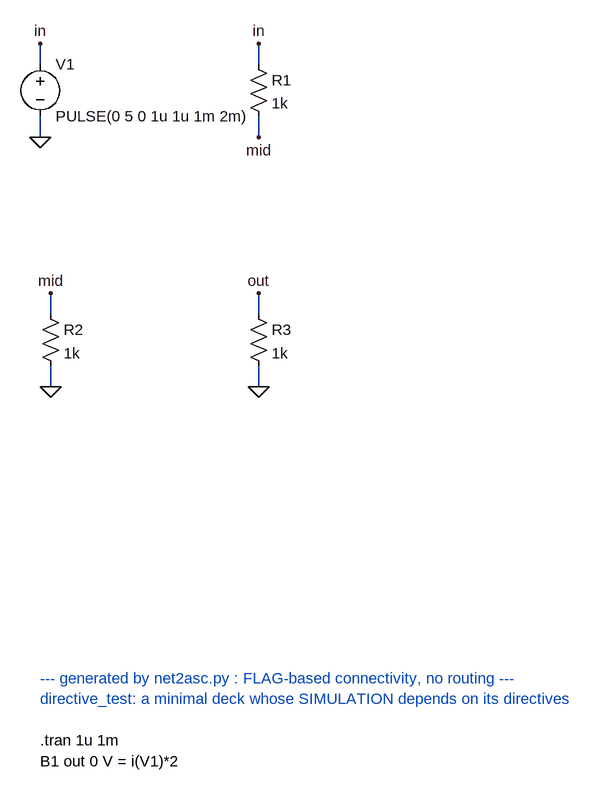
[diagram p0: schematic corrupt_I_icdel.asc]
corrupt_I_icdel.asc, the LTspice schematic file:
Version 4
SHEET 1 880 1288
WIRE 0 16 0 -16
WIRE 0 96 0 128
WIRE 336 16 336 -16
WIRE 336 96 336 128
WIRE 16 400 16 368
WIRE 16 480 16 512
WIRE 336 400 336 368
WIRE 336 480 336 512
FLAG 0 -16 in
FLAG 0 128 0
FLAG 336 -16 in
FLAG 336 128 mid
FLAG 16 368 mid
FLAG 16 512 0
FLAG 336 368 out
FLAG 336 512 0
SYMBOL voltage 0 0 R0
SYMATTR InstName V1
SYMATTR Value PULSE(0 5 0 1u 1u 1m 2m)
SYMBOL res 320 0 R0
SYMATTR InstName R1
SYMATTR Value 1k
SYMBOL res 0 384 R0
SYMATTR InstName R2
SYMATTR Value 1k
SYMBOL res 320 384 R0
SYMATTR InstName R3
SYMATTR Value 1k
TEXT 0 960 Left 2 ;--- generated by net2asc.py : FLAG-based connectivity, no routing ---
TEXT 0 992 Left 2 ;directive_test: a minimal deck whose SIMULATION depends on its directives
TEXT 0 1056 Left 2 !.tran 1u 1m
TEXT 0 1088 Left 2 !B1 out 0 V = i(V1)*2

The netlist it stands for:
* corrupt_I_icdel.asc
V1 in 0 PULSE(0 5 0 1u 1u 1m 2m)
R1 in mid 1k
R2 mid 0 1k
R3 out 0 1k
* --- generated by net2asc.py : FLAG-based connectivity, no routing ---
* directive_test: a minimal deck whose SIMULATION depends on its directives
.tran 1u 1m
B1 out 0 V = i(V1)*2
.backanno
.end